# Altium schematic sheet MCU103A_F2800137_Device.SchDoc
size 431 x 279 mm; Date: Not shown in title block; ApprovedBy: Not shown in title block; CheckedBy: Not shown in title block; Author: Not shown in title block; CompanyName: Not shown in title block; Engineer: Not shown in title block; Organization: Not shown in title block; Address1: Not shown in title block; Address2: Not shown in title block; Address3: Not shown in title block; Address4: Not shown in title block; DocumentNumber: 4; Revision: Use project parameter SCH_Rev; SheetNumber: 5; SheetTotal: 8; PageSetup: Record=PageOptions|CenterHorizontal=True|CenterVertical=True|PrintScale=1.00|XCorrection=1.00|YCorrection=1.00|PrintKind=0|BorderSize=5000000|LeftOffset=0|BottomOffset=0|Orientation=2|PaperLength=1000|PaperWidth=1000|Scale=100|PaperSource=15|PrintQuality=600|MediaType=1|DitherType=10|PaperKind=Letter|PrintScaleMode=1; CurrentTime: Not shown in title block; CurrentDate: Not shown in title block; Time: Not shown in title block; DocumentFullPathAndName: Not shown in title block; DocumentName: Not shown in title block; ModifiedDate: Not shown in title block; ImagePath: Not shown in title block
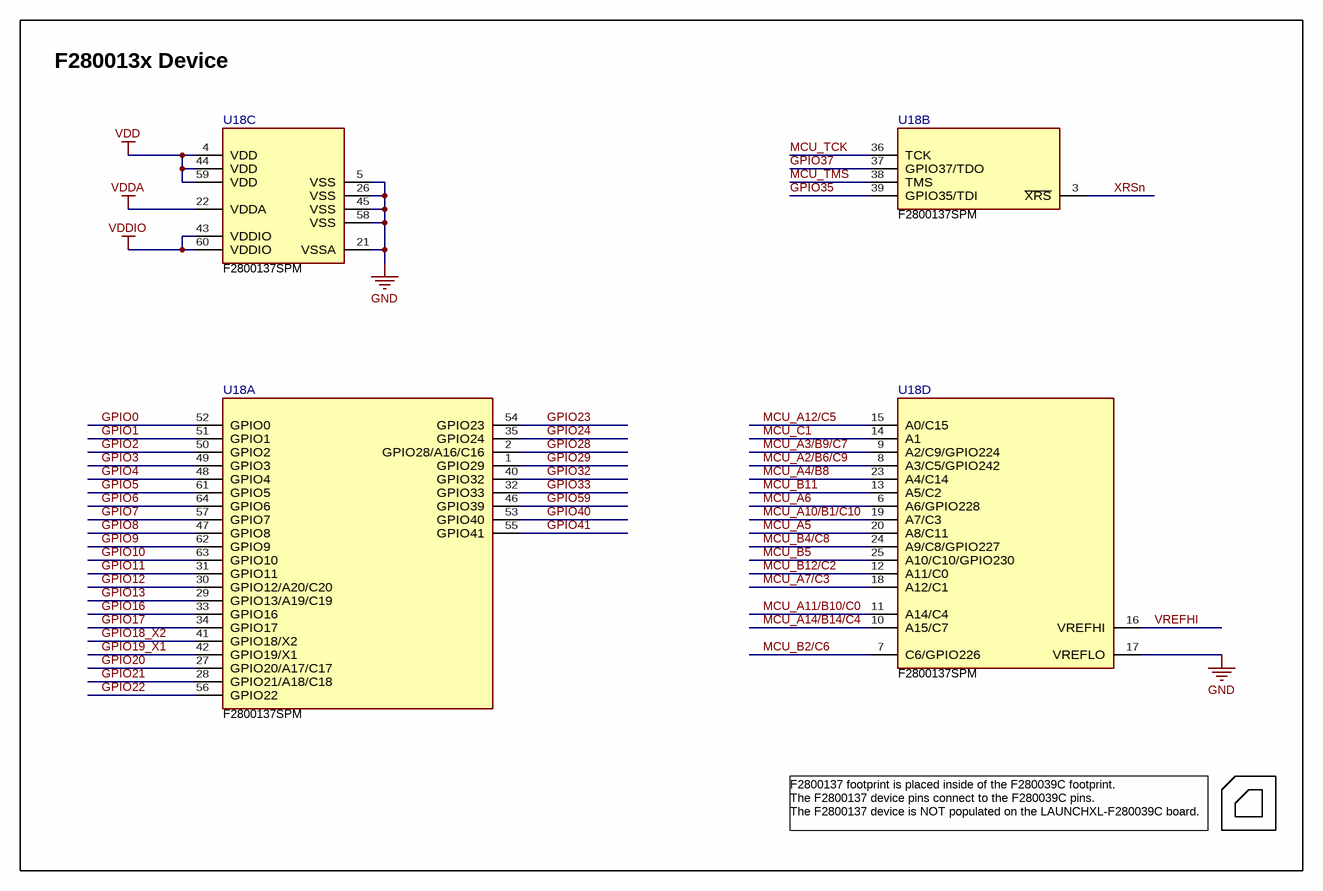
[diagram p0: MCU103A_F2800137_Device.SchDoc]

## Parts
U18  F2800137SPM  [PM0064A-IPC_C]  (parts A,B,C,D of 4)

## Blocks framed on the sheet
F280013x Device: U18

## Nets
GND: U18.5(VSS) U18.17(VREFLO) U18.21(VSSA) U18.26(VSS) U18.45(VSS) U18.58(VSS)
VDD: U18.4(VDD) U18.44(VDD) U18.59(VDD)
VDDA: U18.22(VDDA)
VDDIO: U18.43(VDDIO) U18.60(VDDIO)
GPIO0: U18.52(GPIO0)
GPIO1: U18.51(GPIO1)
GPIO2: U18.50(GPIO2)
GPIO3: U18.49(GPIO3)
GPIO4: U18.48(GPIO4)
GPIO5: U18.61(GPIO5)
GPIO6: U18.64(GPIO6)
GPIO7: U18.57(GPIO7)
GPIO8: U18.47(GPIO8)
GPIO9: U18.62(GPIO9)
GPIO10: U18.63(GPIO10)
GPIO11: U18.31(GPIO11)
GPIO12: U18.30(GPIO12/A20/C20)
GPIO13: U18.29(GPIO13/A19/C19)
GPIO16: U18.33(GPIO16)
GPIO17: U18.34(GPIO17)
GPIO18_X2: U18.41(GPIO18/X2)
GPIO19_X1: U18.42(GPIO19/X1)
GPIO20: U18.27(GPIO20/A17/C17)
GPIO21: U18.28(GPIO21/A18/C18)
GPIO22: U18.56(GPIO22)
GPIO23: U18.54(GPIO23)
GPIO24: U18.35(GPIO24)
GPIO28: U18.2(GPIO28/A16/C16)
GPIO29: U18.1(GPIO29)
GPIO32: U18.40(GPIO32)
GPIO33: U18.32(GPIO33)
GPIO35: U18.39(GPIO35/TDI)
GPIO37: U18.37(GPIO37/TDO)
GPIO40: U18.53(GPIO40)
GPIO41: U18.55(GPIO41)
GPIO59: U18.46(GPIO39)
MCU_A2/B6/C9: U18.8(A3/C5/GPIO242)
MCU_A3/B9/C7: U18.9(A2/C9/GPIO224)
MCU_A4/B8: U18.23(A4/C14)
MCU_A5: U18.20(A8/C11)
MCU_A6: U18.6(A6/GPIO228)
MCU_A7/C3: U18.18(A12/C1)
MCU_A10/B1/C10: U18.19(A7/C3)
MCU_A11/B10/C0: U18.11(A14/C4)
MCU_A12/C5: U18.15(A0/C15)
MCU_A14/B14/C4: U18.10(A15/C7)
MCU_B2/C6: U18.7(C6/GPIO226)
MCU_B4/C8: U18.24(A9/C8/GPIO227)
MCU_B5: U18.25(A10/C10/GPIO230)
MCU_B11: U18.13(A5/C2)
MCU_B12/C2: U18.12(A11/C0)
MCU_C1: U18.14(A1)
MCU_TCK: U18.36(TCK)
MCU_TMS: U18.38(TMS)
VREFHI: U18.16(VREFHI)
XRSn: U18.3(~{XRS})

## Notes on the sheet
- F2800137 footprint is placed inside of the F280039C footprint.
  The F2800137 device pins connect to the F280039C pins.
  The F2800137 device is NOT populated on the LAUNCHXL-F280039C board.
- Drawn By:
- SVN Rev:
- Number:
- TID #:
- Orderable:
- Rev:
- Sheet Title:
- File:
- Project Title:
- Designed for:
- Assembly Variant:
- Mod. Date:
- Sheet:
- Size:
- of
- B
- http://www.ti.com
- Texas Instruments and/or its licensors do not warrant the accuracy or completeness of this specification or any information contained therein. Texas Instruments and/or its licensors do not warrant that this design will meet the specifications, will be suitable for your application or fit for any particular purpose, or will operate in an implementation. Texas Instruments and/or its licensors do not warrant that the design is production worthy. You should completely validate and test your design implementation to confirm the system functionality for your application.
- Engineer:
- Contact:
- © Texas Instruments

## Library data of the parts
U18 = CMP-0092020-1: Manufacturer: Texas Instruments; Standoff Height: 0.05mm; SizeZ_mm: 1.6mm; Part Number: F2800137SPM; Datasheet Path: datasheets/-F2800137SPM.pdf; PartNumber: F2800137SPM; PackageReference: LQFP64; helpURL: https://upverter.com/upn/revision/9bbda0e19f6e20ca/; RoHS: UNKNOWN; Operating Temperature Range: to; PartId: 1